# Altium project Card_Reader.PrjPcb
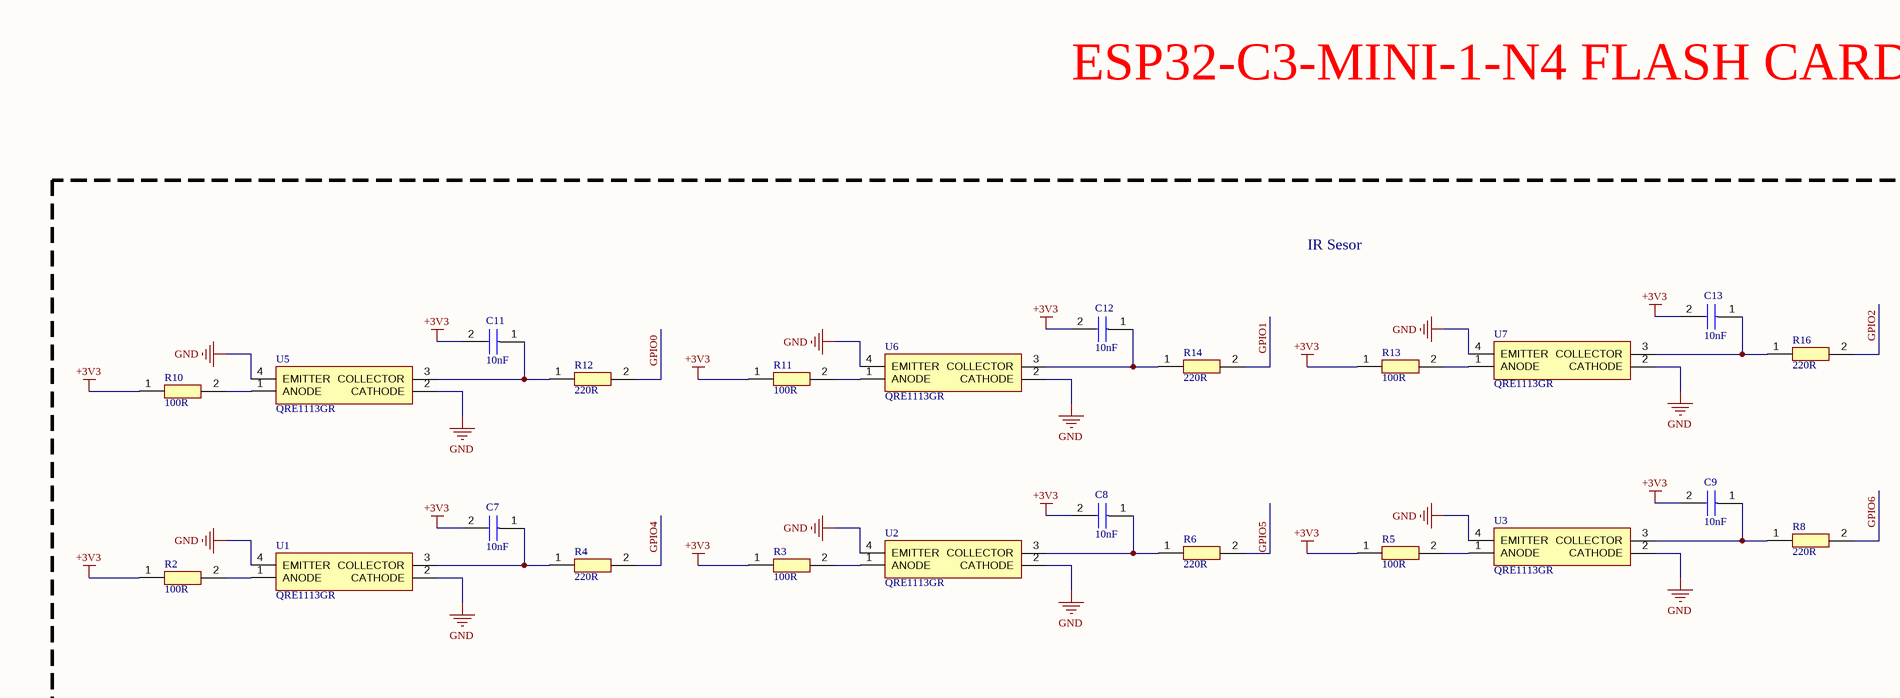
[diagram p0: Schematic.SchDoc, top left]
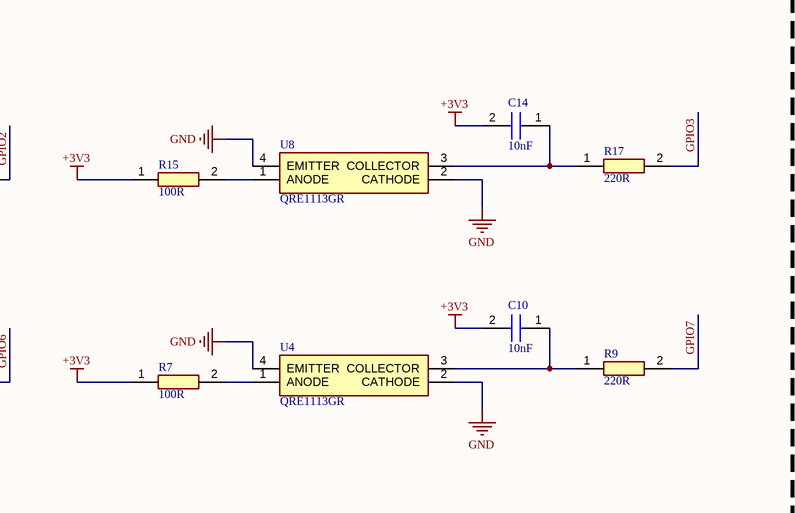
[diagram p1: Schematic.SchDoc, top right]
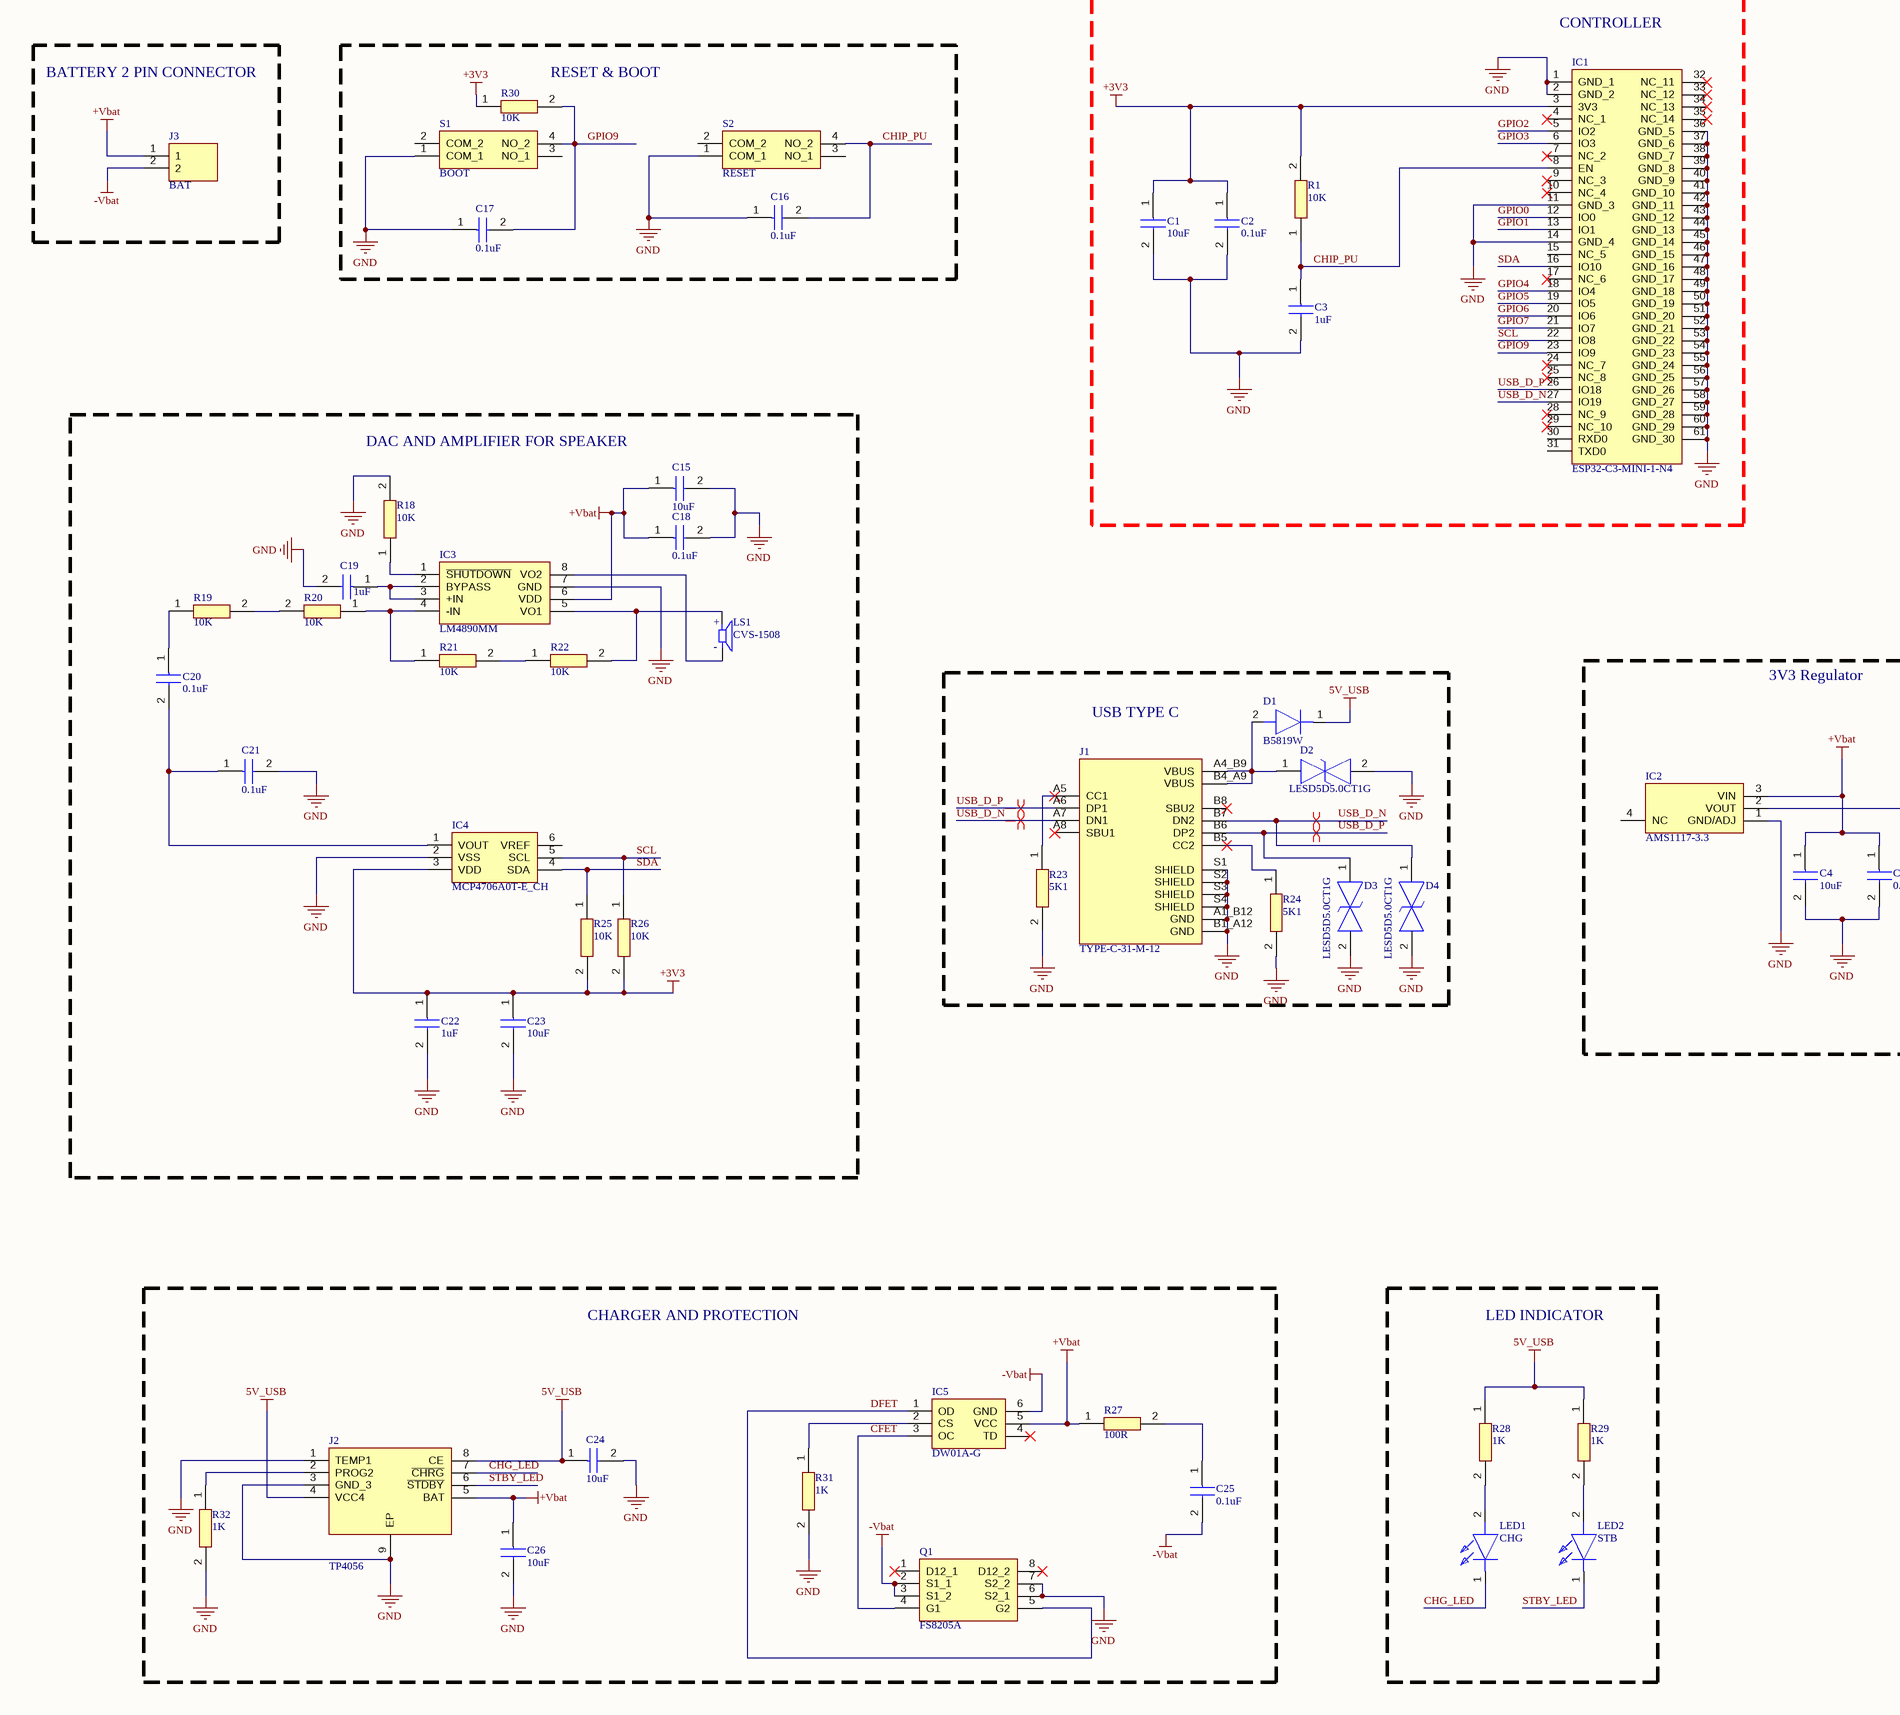
[diagram p2: Schematic.SchDoc, bottom left]
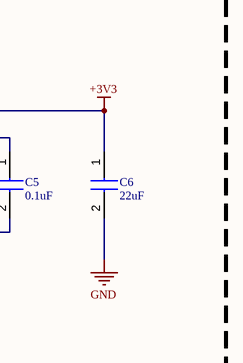
[diagram p3: Schematic.SchDoc, bottom right]
1 sheet, 84 parts. Net scope: global (net labels, ports and power ports of the same name join across sheets).
Board file: PCB_Design.PcbDoc

## Sheet Schematic.SchDoc
size 863 x 558 mm; SheetNumber: 1; SheetTotal: 1

### Parts
C1  10uF  [CAPC1608X95N]
C2  0.1uF  [GRM033D70J224ME01D]
C3  1uF  [CAPC1608X90N]
C4  10uF  [CAPC1608X95N]
C5  0.1uF  [GRM033D70J224ME01D]
C6  22uF  [CAPC1608X80N]
C7  10nF  [CAPC1005X55N]
C8  10nF  [CAPC1005X55N]
C9  10nF  [CAPC1005X55N]
C10  10nF  [CAPC1005X55N]
C11  10nF  [CAPC1005X55N]
C12  10nF  [CAPC1005X55N]
C13  10nF  [CAPC1005X55N]
C14  10nF  [CAPC1005X55N]
C15  10uF  [CAPC1608X95N]
C16  0.1uF  [GRM033D70J224ME01D]
C17  0.1uF  [GRM033D70J224ME01D]
C18  0.1uF  [GRM033D70J224ME01D]
C19  1uF  [CAPC1608X90N]
C20  0.1uF  [GRM033D70J224ME01D]
C21  0.1uF  [GRM033D70J224ME01D]
C22  1uF  [CAPC1608X90N]
C23  10uF  [CAPC1608X95N]
C24  10uF  [CAPC1608X95N]
C25  0.1uF  [GRM033D70J224ME01D]
C26  10uF  [CAPC1608X95N]
D1  B5819W  [SOD3716X135N]
D2  LESD5D5.0CT1G  [LESD5D50CT1G]
D3  LESD5D5.0CT1G  [LESD5D50CT1G]
D4  LESD5D5.0CT1G  [LESD5D50CT1G]
IC1  ESP32-C3-MINI-1-N4  [ESP32C3MINI1N4]
IC2  AMS1117-3.3  [SOT229P700X180-4N]
IC3  LM4890MM  [SOP65P490X110-8N]
IC4  MCP4706A0T-E_CH  [SOT95P270X145-6N]
IC5  DW01A-G  [SOT95P190X145-6N]
J1  TYPE-C-31-M-12  [HRO_TYPE-C-31-M-12]
J2  TP4056  [SOIC127P600X175-9N]
J3  BAT  [SHDR2W64P0X250_1X2_740X575X700P]
LED1  CHG  [LEDC1608X80N]
LED2  STB  [LEDC1608X80N]
LS1  CVS-1508  [SPKR_CVS-1508]
Q1  FS8205A  [SOP65P640X120-8N]
R1  10K  [RESC1608X55N]
R2  100R  [RESC2013X65N]
R3  100R  [RESC2013X65N]
R4  220R  [RESC1608X55N]
R5  100R  [RESC2013X65N]
R6  220R  [RESC1608X55N]
R7  100R  [RESC2013X65N]
R8  220R  [RESC1608X55N]
R9  220R  [RESC1608X55N]
R10  100R  [RESC2013X65N]
R11  100R  [RESC2013X65N]
R12  220R  [RESC1608X55N]
R13  100R  [RESC2013X65N]
R14  220R  [RESC1608X55N]
R15  100R  [RESC2013X65N]
R16  220R  [RESC1608X55N]
R17  220R  [RESC1608X55N]
R18  10K  [RESC1608X55N]
R19  10K  [RESC1608X55N]
R20  10K  [RESC1608X55N]
R21  10K  [RESC1608X55N]
R22  10K  [RESC1608X55N]
R23  5K1  [RESC1608X55N]
R24  5K1  [RESC1608X55N]
R25  10K  [RESC1608X55N]
R26  10K  [RESC1608X55N]
R27  100R  [RESC2013X65N]
R28  1K  [RESC1608X55N]
R29  1K  [RESC1608X55N]
R30  10K  [RESC1608X55N]
R31  1K  [RESC1608X55N]
R32  1K  [RESC1608X55N]
S1  BOOT  [414375652]
S2  RESET  [414375652]
U1  QRE1113GR  [QRE1113GR]
U2  QRE1113GR  [QRE1113GR]
U3  QRE1113GR  [QRE1113GR]
U4  QRE1113GR  [QRE1113GR]
U5  QRE1113GR  [QRE1113GR]
U6  QRE1113GR  [QRE1113GR]
U7  QRE1113GR  [QRE1113GR]
U8  QRE1113GR  [QRE1113GR]

### Blocks framed on the sheet
IR Sesor: C7-C14 R2-R17 U1-U8
CONTROLLER: C1-C3 IC1 R1
BATTERY 2 PIN CONNECTOR: J3
RESET & BOOT: C16 C17 R30 S1 S2
DAC AND AMPLIFIER FOR SPEAKER: C15 C18-C23 IC3 IC4 LS1 R18-R22 R25 R26
USB TYPE C: D1-D4 J1 R23 R24
3V3 Regulator: C4-C6 IC2
CHARGER AND PROTECTION: C24-C26 IC5 J2 Q1 R27 R31 R32
LED INDICATOR: LED1 LED2 R28 R29

### Nets
5V_USB: C24.1 D1.1(K) J2.4(VCC4) J2.8(CE) R28.1 R29.1
+3V3: C1.1 C2.1 C6.1 C7.2 C8.2 C9.2 C10.2 C11.2 C12.2 C13.2 C14.2 C22.1 C23.1 IC1.3(3V3) IC2.2(VOUT) IC4.3(VDD) R1.2 R2.1 R3.1 R5.1 R7.1 R10.1 R11.1 R13.1 R15.1 R25.2 R26.2 R30.1
+Vbat: C4.1 C5.1 C15.1 C18.1 C26.1 IC2.3(VIN) IC3.6(VDD) IC5.5(VCC) J2.5(BAT) J3.1 R27.1
-Vbat: C25.2 IC5.6(GND) J3.2 Q1.2(S1_1) Q1.3(S1_2)
GND: C1.2 C2.2 C3.2 C4.2 C5.2 C6.2 C15.2 C16.1 C17.1 C18.2 C19.2 C21.2 C22.2 C23.2 C24.2 C26.2 D2.2 D3.2 D4.2 IC1.1(GND_1) IC1.2(GND_2) IC1.11(GND_3) IC1.14(GND_4) IC1.36(GND_5) IC1.37(GND_6) IC1.38(GND_7) IC1.39(GND_8) IC1.40(GND_9) IC1.41(GND_10) IC1.42(GND_11) IC1.43(GND_12) IC1.44(GND_13) IC1.45(GND_14) IC1.46(GND_15) IC1.47(GND_16) IC1.48(GND_17) IC1.49(GND_18) IC1.50(GND_19) IC1.51(GND_20) IC1.52(GND_21) IC1.53(GND_22) IC1.54(GND_23) IC1.55(GND_24) IC1.56(GND_25) IC1.57(GND_26) IC1.58(GND_27) IC1.59(GND_28) IC1.60(GND_29) IC1.61(GND_30) IC2.1(GND/ADJ) IC3.7(GND) IC4.2(VSS) J1.A1_B12(GND) J1.B1_A12(GND) J1.S1(SHIELD) J1.S2(SHIELD) J1.S3(SHIELD) J1.S4(SHIELD) J2.1(TEMP1) J2.3(GND_3) J2.9(EP) Q1.6(S2_1) Q1.7(S2_2) R18.2 R23.2 R24.2 R31.2 R32.2 S1.1(COM_1) S2.1(COM_1) U1.2(CATHODE) U1.4(EMITTER) U2.2(CATHODE) U2.4(EMITTER) U3.2(CATHODE) U3.4(EMITTER) U4.2(CATHODE) U4.4(EMITTER) U5.2(CATHODE) U5.4(EMITTER) U6.2(CATHODE) U6.4(EMITTER) U7.2(CATHODE) U7.4(EMITTER) U8.2(CATHODE) U8.4(EMITTER)
CFET: IC5.3(OC) Q1.4(G1)
CHG_LED: J2.7(~{CHRG}) LED1.1(K)
CHIP_PU: C3.1 C16.2 IC1.8(EN) R1.1 S2.4(NO_2)
DFET: IC5.1(OD) Q1.5(G2)
GPIO0: IC1.12(IO0) R12.2
GPIO1: IC1.13(IO1) R14.2
GPIO2: IC1.5(IO2) R16.2
GPIO3: IC1.6(IO3) R17.2
GPIO4: IC1.18(IO4) R4.2
GPIO5: IC1.19(IO5) R6.2
GPIO6: IC1.20(IO6) R8.2
GPIO7: IC1.21(IO7) R9.2
GPIO9: C17.2 IC1.23(IO9) R30.2 S1.4(NO_2)
SCL: IC1.22(IO8) IC4.5(SCL) R26.1
SDA: IC1.16(IO10) IC4.4(SDA) R25.1
STBY_LED: J2.6(~{STDBY}) LED2.1(K)
USB_D_N: D4.1 IC1.27(IO19) J1.A7(DN1) J1.B7(DN2)
USB_D_P: D3.1 IC1.26(IO18) J1.A6(DP1) J1.B6(DP2)
NetC7_1: C7.1 R4.1 U1.3(COLLECTOR)
NetC8_1: C8.1 R6.1 U2.3(COLLECTOR)
NetC9_1: C9.1 R8.1 U3.3(COLLECTOR)
NetC10_1: C10.1 R9.1 U4.3(COLLECTOR)
NetC11_1: C11.1 R12.1 U5.3(COLLECTOR)
NetC12_1: C12.1 R14.1 U6.3(COLLECTOR)
NetC13_1: C13.1 R16.1 U7.3(COLLECTOR)
NetC14_1: C14.1 R17.1 U8.3(COLLECTOR)
NetC19_1: C19.1 IC3.2(BYPASS) IC3.3(+IN)
NetC20_1: C20.1 R19.1
NetC20_2: C20.2 C21.1 IC4.1(VOUT)
NetC25_1: C25.1 R27.2
NetD1_2: D1.2(A) D2.1 J1.A4_B9(VBUS) J1.B4_A9(VBUS)
NetIC3_1: IC3.1(~{SHUTDOWN}) R18.1
NetIC3_4: IC3.4(-IN) R20.1 R21.1
NetIC3_5: IC3.5(VO1) LS1.P R22.2
NetIC3_8: IC3.8(VO2) LS1.M
NetIC5_2: IC5.2(CS) R31.1
NetJ1_A5: J1.A5(CC1) R23.1
NetJ1_B5: J1.B5(CC2) R24.1
NetJ2_2: J2.2(PROG2) R32.1
NetLED1_2: LED1.2(A) R28.2
NetLED2_2: LED2.2(A) R29.2
NetR2_2: R2.2 U1.1(ANODE)
NetR3_2: R3.2 U2.1(ANODE)
NetR5_2: R5.2 U3.1(ANODE)
NetR7_2: R7.2 U4.1(ANODE)
NetR10_2: R10.2 U5.1(ANODE)
NetR11_2: R11.2 U6.1(ANODE)
NetR13_2: R13.2 U7.1(ANODE)
NetR15_2: R15.2 U8.1(ANODE)
NetR19_2: R19.2 R20.2
NetR21_2: R21.2 R22.1

Not connected (* = marked no-connect by the designer): IC1 4(NC_1)* 7(NC_2)* 9(NC_3)* 10(NC_4)* 15(NC_5) 17(NC_6)* 24(NC_7)* 25(NC_8)* 28(NC_9)* 29(NC_10)* 30(RXD0) 31(TXD0) 32(NC_11)* 33(NC_12)* 34(NC_13)* 35(NC_14)*; IC2 4(NC); IC4 6(VREF); IC5 4(TD)*; J1 A8(SBU1)* B8(SBU2)*; Q1 1(D12_1)* 8(D12_2)*; S1 2(COM_2) 3(NO_1); S2 2(COM_2) 3(NO_1)

### Layout directives
differential pair: USB_D_N, USB_D_P

### Notes on the sheet
- ESP32-C3-MINI-1-N4 FLASH CARD READER
- DWG. NO.
- REV.
- SHT.
- REVISION
- DESCRIPTION
- DATE
- APPROVED
- THIS DOCUMENT AND THE DATA DISCLOSED HEREIN OR HEREWITH IS THE PROPERTY OF ALTIUM LIMITED AND MAY BE FREELY DISTRIBUTED IN WHOLE. NO RIGHTS ARE RESERVED OR EXPRESS OR IMPLIED WARANTEE GIVEN.
- ENG:
- DSN:
- APPROVALS
- PROJECT
- DOCUMENT REVISION:
- DESIGN ITEM:
- CHK:
- BOM:
- REFERENCE DOCUMENTS
- PROJECT REVISION:
- TITLE
- FAB DWG:
- PCB DWG:
- ASSY DWG:
- SCALE:
- SIZE
- D
- CAGE CODE
- FILE NAME
- DWG NO.
- SHEET
- OF
- REV
- (in symbol CVS-1508) +; -

### Library data of the parts
C1 C4 C15 C23 C24 C26 = CL10A106MO8NQNC: Capacitor; Manufacturer_Name: SAMSUNG; Datasheet Link: https://product.samsungsem.com/mlcc/CL10A106MO8NQN.do; Height: 0.95mm; Manufacturer_Part_Number: CL10A106MO8NQNC; Mouser Part Number: 187-CL10A106MO8NQNC; Mouser Price/Stock: https://www.mouser.co.uk/ProductDetail/Samsung-Electro-Mechanics/CL10A106MO8NQNC?qs=X6jEic%2FHinCV9WAzCvTcwg%3D%3D; Arrow Part Number: CL10A106MO8NQNC; Arrow Price/Stock: https://www.arrow.com/en/products/cl10a106mo8nqnc/samsung-electro-mechanics?region=nac; LCSC Part Number: C92487
C2 C5 C16-C18 C20 C21 C25 = GRM033Z71C104KE14J: Capacitor; Manufacturer_Name: Murata Electronics; Datasheet Link: https://search.murata.co.jp/Ceramy/image/img/A01X/G101/ENG/GRM033Z71C104KE14-01A.pdf; Height: 0.33mm; Manufacturer_Part_Number: GRM033Z71C104KE14J; Mouser Part Number: 81-GRM033Z71C104KE4J; Mouser Price/Stock: https://www.mouser.co.uk/ProductDetail/Murata-Electronics/GRM033Z71C104KE14J?qs=lEfY3O89AqkOnRdov738ag%3D%3D; LCSC Part Number: C5755505
C3 C19 C22 = CL10A105KP8NNNC: Capacitor; Manufacturer_Name: SAMSUNG; Datasheet Link: https://datasheet.lcsc.com/szlcsc/Samsung-Electro-Mechanics-CL10A105KP8NNNC_C26413.pdf; Height: 0.9mm; Manufacturer_Part_Number: CL10A105KP8NNNC; Mouser Part Number: 187-CL10A105KP8NNNC; Mouser Price/Stock: https://www.mouser.co.uk/ProductDetail/Samsung-Electro-Mechanics/CL10A105KP8NNNC?qs=349EhDEZ59qtu6tL%2F73n2A%3D%3D; Arrow Part Number: CL10A105KP8NNNC; Arrow Price/Stock: https://www.arrow.com/en/products/cl10a105kp8nnnc/samsung-electro-mechanics?region=europe; LCSC Part Number: C26413
C6 = CL10A226MO7JZNC: Capacitor; Manufacturer_Name: SAMSUNG; Datasheet Link: https://www.mouser.es/datasheet/2/585/MLCC-1837944.pdf; Height: 0.8mm; Manufacturer_Part_Number: CL10A226MO7JZNC; Mouser Part Number: 187-CL10A226MO7JZNC; Mouser Price/Stock: https://www.mouser.co.uk/ProductDetail/Samsung-Electro-Mechanics/CL10A226MO7JZNC?qs=xZ%2FP%252Ba9zWqb2i0I9rwAjeg%3D%3D; Arrow Part Number: CL10A226MO7JZNC; Arrow Price/Stock: https://www.arrow.com/en/products/cl10a226mo7jznc/samsung-electro-mechanics?utm_currency=USD&region=europe; LCSC Part Number: C2762594
C7-C14 = CC0402KRX7R5BB103: Capacitor; Manufacturer_Name: KEMET; Datasheet Link: https://componentsearchengine.com/Datasheets/1/CC0402KRX7R5BB103.pdf; Height: 0.55mm; Manufacturer_Part_Number: CC0402KRX7R5BB103; Mouser Part Number: 603-CC0402KRX7R5BB10; Mouser Price/Stock: https://www.mouser.com/Search/Refine.aspx?Keyword=603-CC0402KRX7R5BB10
D1 = B5819W: Diode; Manufacturer_Name: Good-Ark; Datasheet Link: https://www.mouser.com/ds/2/258/B5817W-B5819W(SOD-123)-276623.pdf; Height: 1.35mm; Manufacturer_Part_Number: B5819W; Arrow Part Number: B5819W; Arrow Price/Stock: https://www.arrow.com/en/products/b5819w/good-ark-semiconductor?utm_currency=USD&region=nac
D2-D4 = LESD5D5.0CT1G: TVS Diode (Bi-directional); Manufacturer_Name: LRC; Height: 0.7mm; Manufacturer_Part_Number: LESD5D5.0CT1G
IC1 = ESP32-C3-MINI-1-N4: Integrated Circuit; Manufacturer_Name: Espressif Systems; Datasheet Link: https://www.mouser.com/datasheet/2/891/Espressif_ESP32_C3_MINI_1_Datasheet-2006822.pdf; Height: 2.55mm; Manufacturer_Part_Number: ESP32-C3-MINI-1-N4; Mouser Part Number: 356-ESP32-C3-MINI1N4; Mouser Price/Stock: https://www.mouser.co.uk/ProductDetail/Espressif-Systems/ESP32-C3-MINI-1-N4?qs=stqOd1AaK7%252B%2FpH3qqyGehA%3D%3D; LCSC Part Number: C2838502
IC2 = AMS1117-3.3: Integrated Circuit; Manufacturer_Name: UMW; Datasheet Link: https://www.lcsc.com/datasheet/lcsc_datasheet_2412201207_UMW-Youtai-Semiconductor-Co---Ltd--AMS1117-3-3_C347222.pdf; Manufacturer_Part_Number: AMS1117-3.3; LCSC Part number: C6186
IC3 = LM4890MM: Integrated Circuit; Manufacturer_Name: Texas Instruments; Datasheet Link: https://www.ti.com/lit/ds/symlink/lm4890.pdf?ts=1634792281842&ref_url=https%253A%252F%252Fwww.google.com%252F; Height: 1.1mm; Manufacturer_Part_Number: LM4890MM; Mouser Part Number: 926-LM4890MM; Mouser Price/Stock: https://www.mouser.co.uk/ProductDetail/Texas-Instruments/LM4890MM?qs=QbsRYf82W3FbQ20Kj%2FLeow%3D%3D
IC4 = MCP4706A0T-E_CH: Integrated Circuit; Manufacturer_Name: Microchip; Manufacturer_Part_Number: MCP4706A0T-E/CH; Datasheet Link: http://ww1.microchip.com/downloads/en/DeviceDoc/22272C.pdf; Height: 1.45mm; Mouser Part Number: 579-MCP4706A0TECH; Mouser Price/Stock: https://www.mouser.co.uk/ProductDetail/Microchip-Technology-Atmel/MCP4706A0T-E-CH?qs=ggQiQSXuoRUkD%252B70FRFHMA%3D%3D; Arrow Part Number: MCP4706A0T-E/CH; Arrow Price/Stock: https://www.arrow.com/en/products/mcp4706a0t-ech/microchip-technology?region=nac; LCSC part number: C2649360
IC5 = DW01A-G: Integrated Circuit; Manufacturer_Name: SII Semiconductor; Datasheet Link: http://www.ic-fortune.com/upload/Download/DW01x-DS-17_EN.pdf; Height: 1.45mm; Manufacturer_Part_Number: DW01A-G
J1 = TYPE-C-31-M-12: USB Connectors 24 Receptacle 1 8.94*7.3mm RoHS; MF: HRO Electronics Co., Ltd.; SnapEDA_Link: https://www.snapeda.com/parts/TYPE-C-31-M-12/HRO+Electronics+Co.%252C+Ltd./view-part/?ref=snap; Package: Package; Value: *; MP: TYPE-C-31-M-12; Check_prices: https://www.snapeda.com/parts/TYPE-C-31-M-12/HRO+Electronics+Co.%252C+Ltd./view-part/?ref=eda
J2 = TP4056: Connector; Manufacturer_Name: NanJing Top Power; Datasheet Link: https://dlnmh9ip6v2uc.cloudfront.net/datasheets/Prototyping/TP4056.pdf; Height: 1.75mm; Manufacturer_Part_Number: TP4056
J3 = B2B-XH-A_LF__SN_: Connector; Manufacturer_Name: JST (JAPAN SOLDERLESS TERMINALS); Manufacturer_Part_Number: B2B-XH-A(LF)(SN); Datasheet Link: http://www.jst-mfg.com/product/pdf/eng/eXH.pdf; Height: 7mm; Mouser Part Number: 306-B2BXHALFSNP; Mouser Price/Stock: https://www.mouser.co.uk/ProductDetail/JST-Commercial/B2B-XH-ALFSN?qs=cdbOS8ANM9DdcSn9qRmfCw%3D%3D; Arrow Part Number: B2B-XH-A(LF)(SN); Arrow Price/Stock: https://www.arrow.com/en/products/b2b-xh-a-lf-sn/jst-manufacturing?utm_currency=USD&region=europe
LED1 LED2 = LTST-C190KRKT: LED; Manufacturer_Name: Lite-On; Datasheet Link: https://componentsearchengine.com/Datasheets/1/LTST-C190KRKT.pdf; Height: 0.8mm; Manufacturer_Part_Number: LTST-C190KRKT; Mouser Part Number: 859-LTST-C190KRKT; Mouser Price/Stock: https://www.mouser.co.uk/ProductDetail/LITEON/LTST-C190KRKT?qs=kAD5fFa1n5VY3YYNWPC1Fg%3D%3D; Arrow Part Number: LTST-C190KRKT; Arrow Price/Stock: https://www.arrow.com/en/products/ltst-c190krkt/lite-on-technology?utm_currency=USD&region=europe
LS1 = CVS-1508: 15 mm, Round Frame, 0.3 W, 8 Ohm, Neodymium Magnet, Mylar Cone; MF: CUI Devices; Digi-Key_Part_Number: 102-2498-ND; DigiKey-Purchase-URL: https://snapeda.com/shop?store=DigiKey&id=681641; Package: CUI Inc.; Value: *; SnapEDA_Link: https://www.snapeda.com/parts/CVS-1508/CUI%20Devices/view-part/681641/?ref=snap; MP: CVS-1508; CUI_purchase_URL: https://www.cuidevices.com/product/audio/speakers/miniature-_10-mm~40-mm_/cvs-1508?utm_source=snapeda.com&utm_medium=referral&utm_campaign=snapedaBOM
Q1 = FS8205A: Transistor; Manufacturer_Name: SII Semiconductor; Datasheet Link: http://www.ic-fortune.com/upload/Download/FS8205A-DS-12_EN.pdf; Height: 1.2mm; Manufacturer_Part_Number: FS8205A
R1 R18-R22 R25 R26 R28-R32 = 0603WAF1002T5E: Resistor; Manufacturer_Name: ROYALOHM; Datasheet Link: https://th.mouser.com/datasheet/2/1365/1-3044649.pdf; Height: 0.55mm; Manufacturer_Part_Number: 0603WAF1002T5E; Mouser Part Number: 303-0603WAF1002T5E; Mouser Price/Stock: https://www.mouser.co.uk/ProductDetail/Royalohm/0603WAF1002T5E?qs=e8oIoAS2J1TC2D0IjbSyGA%3D%3D
  R1 R18-R22 R25 R26 R30: LCSC Part number: C25804
R2 R3 R5 R7 R10 R11 R13 R15 R27 = 0805W8F1000T5E: Resistor; Manufacturer_Name: UNI-ROYAL(Uniroyal Elec); Datasheet Link: https://datasheet.lcsc.com/szlcsc/Uniroyal-Elec-0805W8F1000T5E_C17408.pdf; Height: 0.65mm; Manufacturer_Part_Number: 0805W8F1000T5E; LCSC Part Number: C17408
R4 R6 R8 R9 R12 R14 R16 R17 = RC0603FR-07220RL: Resistor; Manufacturer_Name: KEMET; Datasheet Link: http://www.yageo.com/documents/recent/PYu-RC0603_51_RoHS_L_v5.pdf; Height: 0.55mm; Manufacturer_Part_Number: RC0603FR-07220RL; Mouser Part Number: 603-RC0603FR-07220RL; Mouser Price/Stock: https://www.mouser.co.uk/ProductDetail/YAGEO/RC0603FR-07220RL?qs=VU8sRB4EgwA1IyQ0vhXEEw%3D%3D; Arrow Part Number: RC0603FR-07220RL; Arrow Price/Stock: https://www.arrow.com/en/products/rc0603fr-07220rl/yageo?region=nac; LCSC Part number: C107696
R23 R24 = 0603WAF5101T5E: Resistor; Manufacturer_Name: UNI-ROYAL(Uniroyal Elec); Datasheet Link: https://datasheet.lcsc.com/szlcsc/Uniroyal-Elec-0603WAF5101T5E_C23186.pdf; Height: 0.55mm; Manufacturer_Part_Number: 0603WAF5101T5E
S1 S2 = 4-1437565-2: Switch; Manufacturer_Name: TE Connectivity; Datasheet Link: https://www.te.com/commerce/DocumentDelivery/DDEController?Action=showdoc&DocId=Customer+Drawing%7F2-1437565-7%7FV%7Fpdf%7FEnglish%7FENG_CD_2-1437565-7_V.pdf%7F4-1437565-2; Height: 5.38mm; Manufacturer_Part_Number: 4-1437565-2; Arrow Part Number: 4-1437565-2; Arrow Price/Stock: https://www.arrow.com/en/products/4-1437565-2/te-connectivity?region=europe
U1-U8 = QRE1113GR: Undefined or Miscellaneous; Manufacturer_Name: onsemi; Datasheet Link: https://www.onsemi.com/pub/Collateral/QRE1113-D.PDF; Manufacturer_Part_Number: QRE1113GR; Mouser Part Number: 512-QRE1113GR; Mouser Price/Stock: https://www.mouser.co.uk/ProductDetail/onsemi-Fairchild/QRE1113GR?qs=Qb0BA3xILekkPpSVC5x7uQ%3D%3D; Arrow Part Number: QRE1113GR; Arrow Price/Stock: https://www.arrow.com/en/products/qre1113gr/on-semiconductor?utm_currency=USD&region=europe

## Assembly variants
Prototype_1: all parts fitted